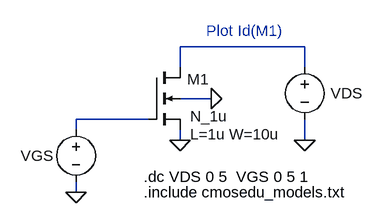
[diagram p0: schematic Fig10_5_NMOS.asc]
Fig10_5_NMOS.asc, the LTspice schematic file:
Version 4
SHEET 1 1136 680
WIRE 640 80 448 80
WIRE 448 112 448 80
WIRE 640 112 640 80
WIRE 496 160 448 160
WIRE 400 192 288 192
WIRE 288 208 288 192
WIRE 448 224 448 208
WIRE 640 224 640 192
WIRE 288 304 288 288
FLAG 288 304 0
FLAG 448 224 0
FLAG 640 224 0
FLAG 496 160 0
SYMBOL nmos4 400 112 R0
WINDOW 0 59 18 Left 0
WINDOW 3 64 75 Left 0
WINDOW 123 64 103 Left 0
SYMATTR InstName M1
SYMATTR Value N_1u
SYMATTR Value2 L=1u W=10u
SYMBOL voltage 288 192 R0
WINDOW 0 -85 56 Left 0
WINDOW 3 24 104 Invisible 0
SYMATTR InstName VGS
SYMATTR Value 0
SYMBOL voltage 640 96 R0
WINDOW 0 40 56 Left 0
WINDOW 3 24 104 Invisible 0
SYMATTR InstName VDS
SYMATTR Value 0
TEXT 392 280 Left 0 !.dc VDS 0 5  VGS 0 5 1
TEXT 392 304 Left 0 !.include cmosedu_models.txt
TEXT 488 56 Left 0 ;Plot Id(M1)

The netlist it stands for:
* Fig10_5_NMOS.asc
M1 N001 N002 0 0 N_1u L=1u W=10u
VGS N002 0 0
VDS N001 0 0
.model NMOS NMOS
.model PMOS PMOS
.lib standard.mos
.dc VDS 0 5  VGS 0 5 1
.include cmosedu_models.txt
* Plot Id(M1)
.backanno
.end